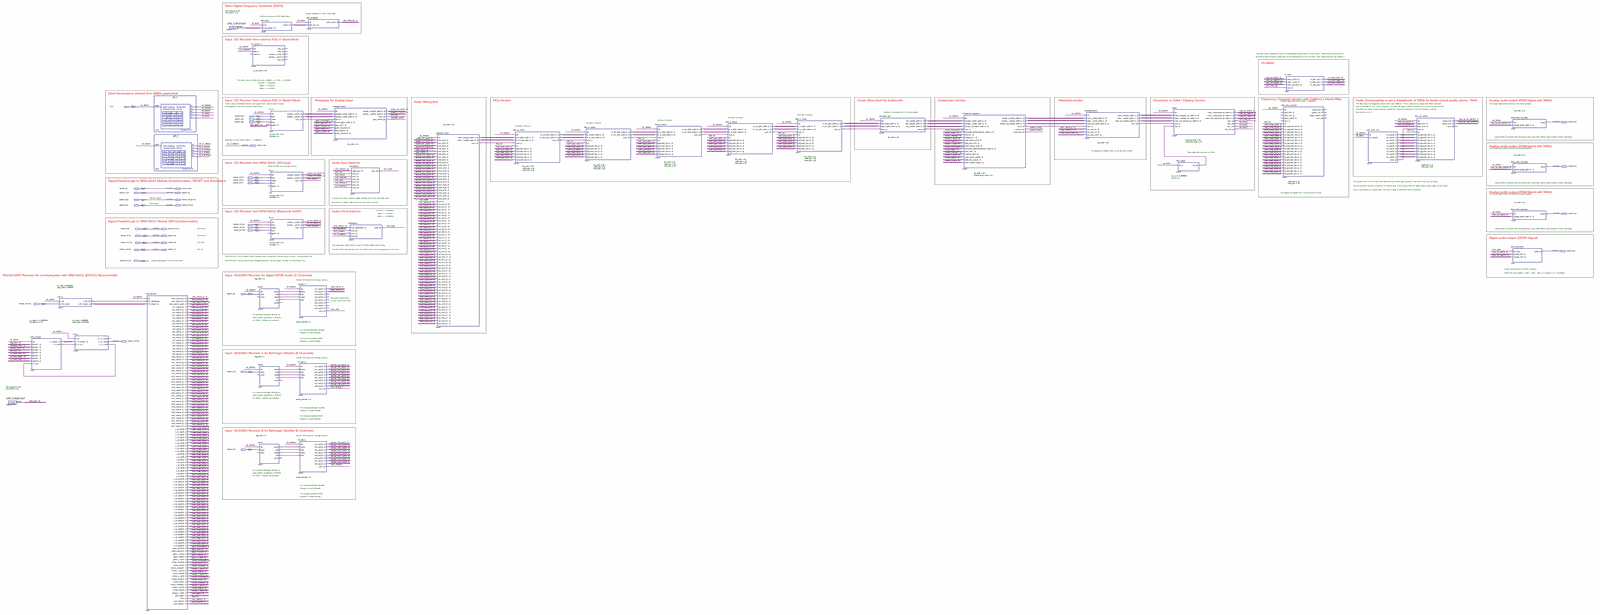
[diagram p0: schematic sheet, whole]
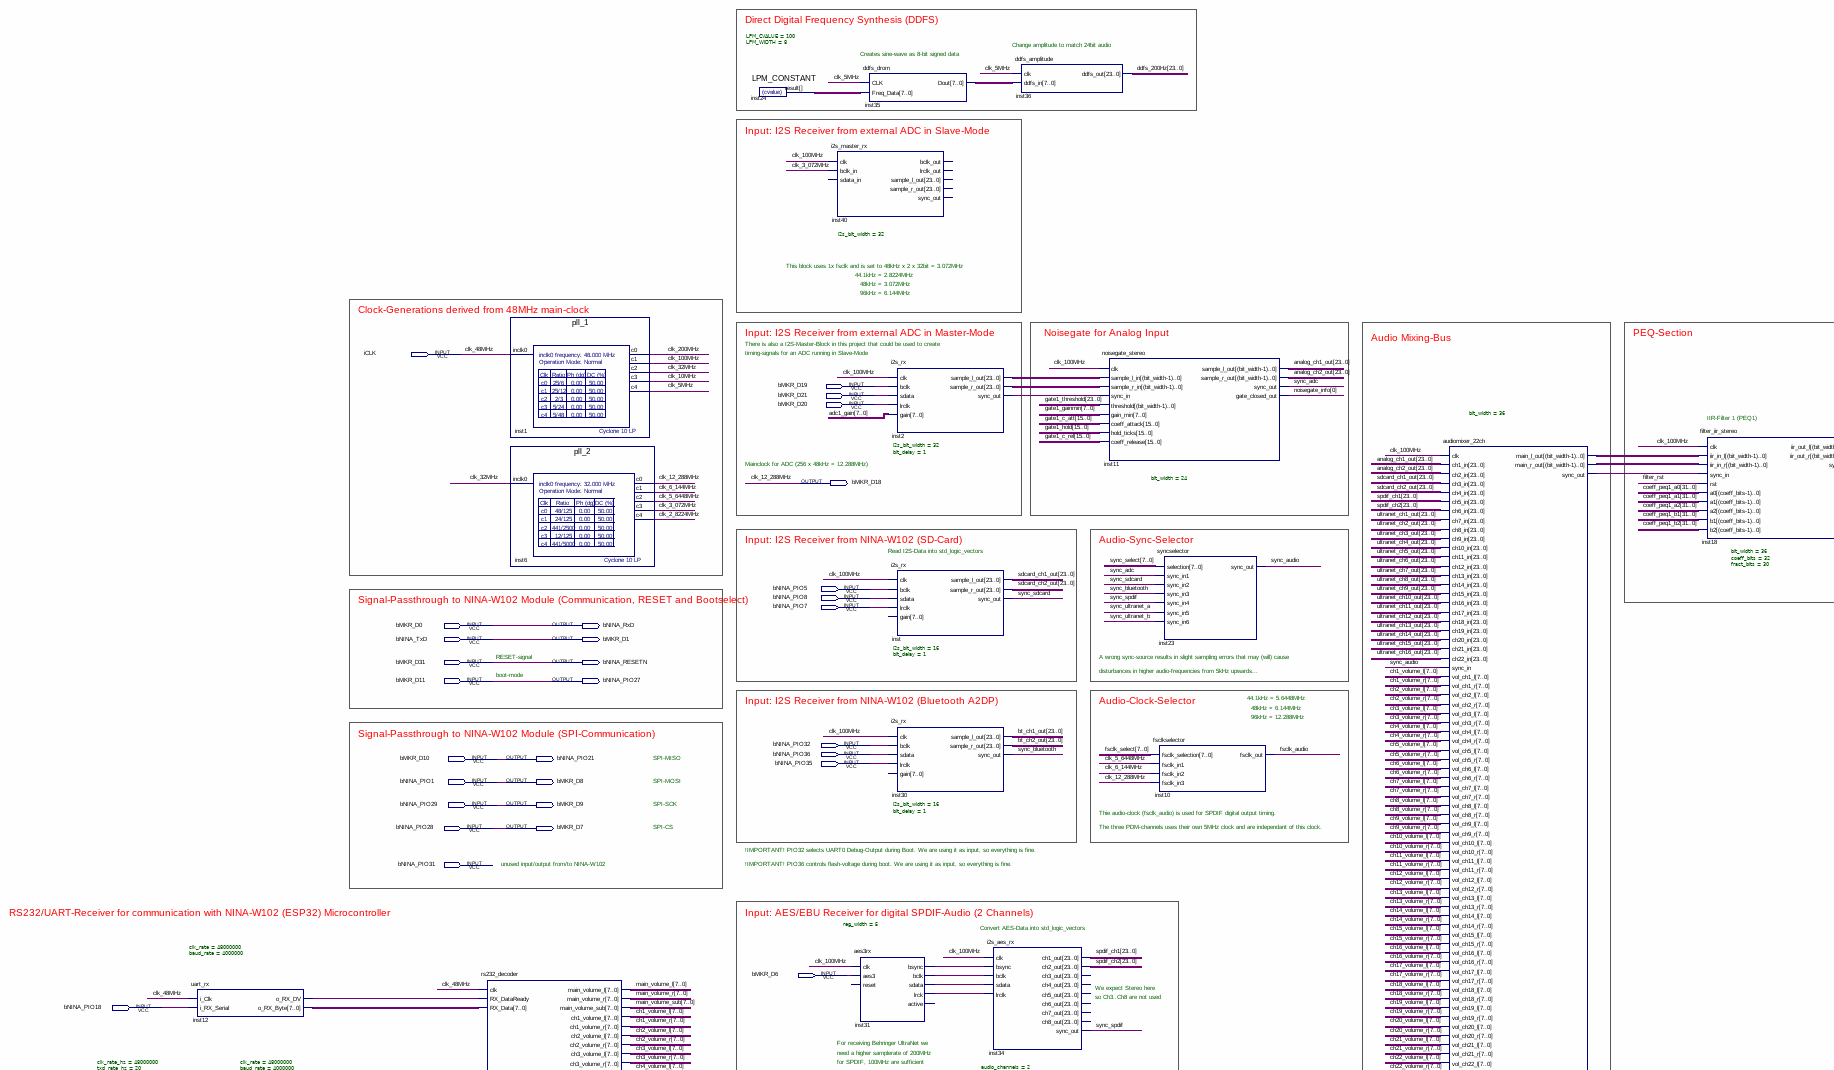
[diagram p1: schematic sheet, upper left part]
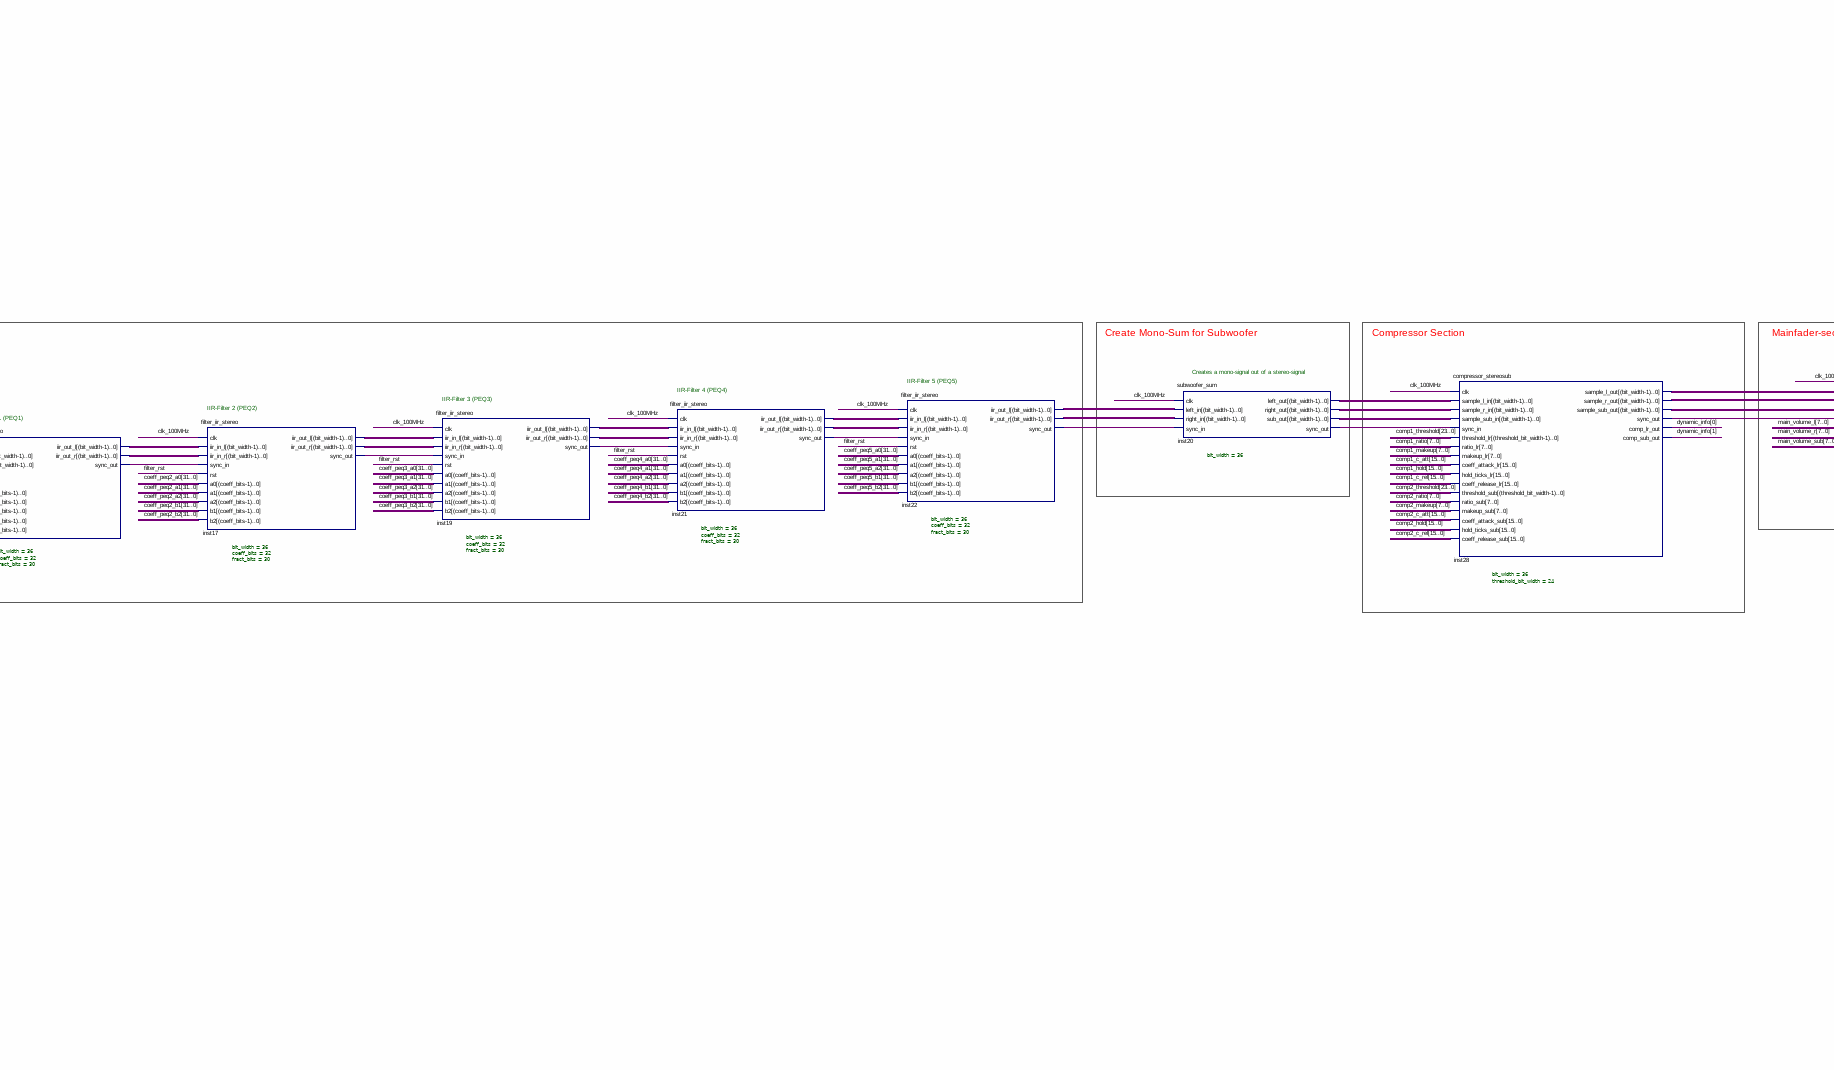
[diagram p2: schematic sheet, upper centre part]
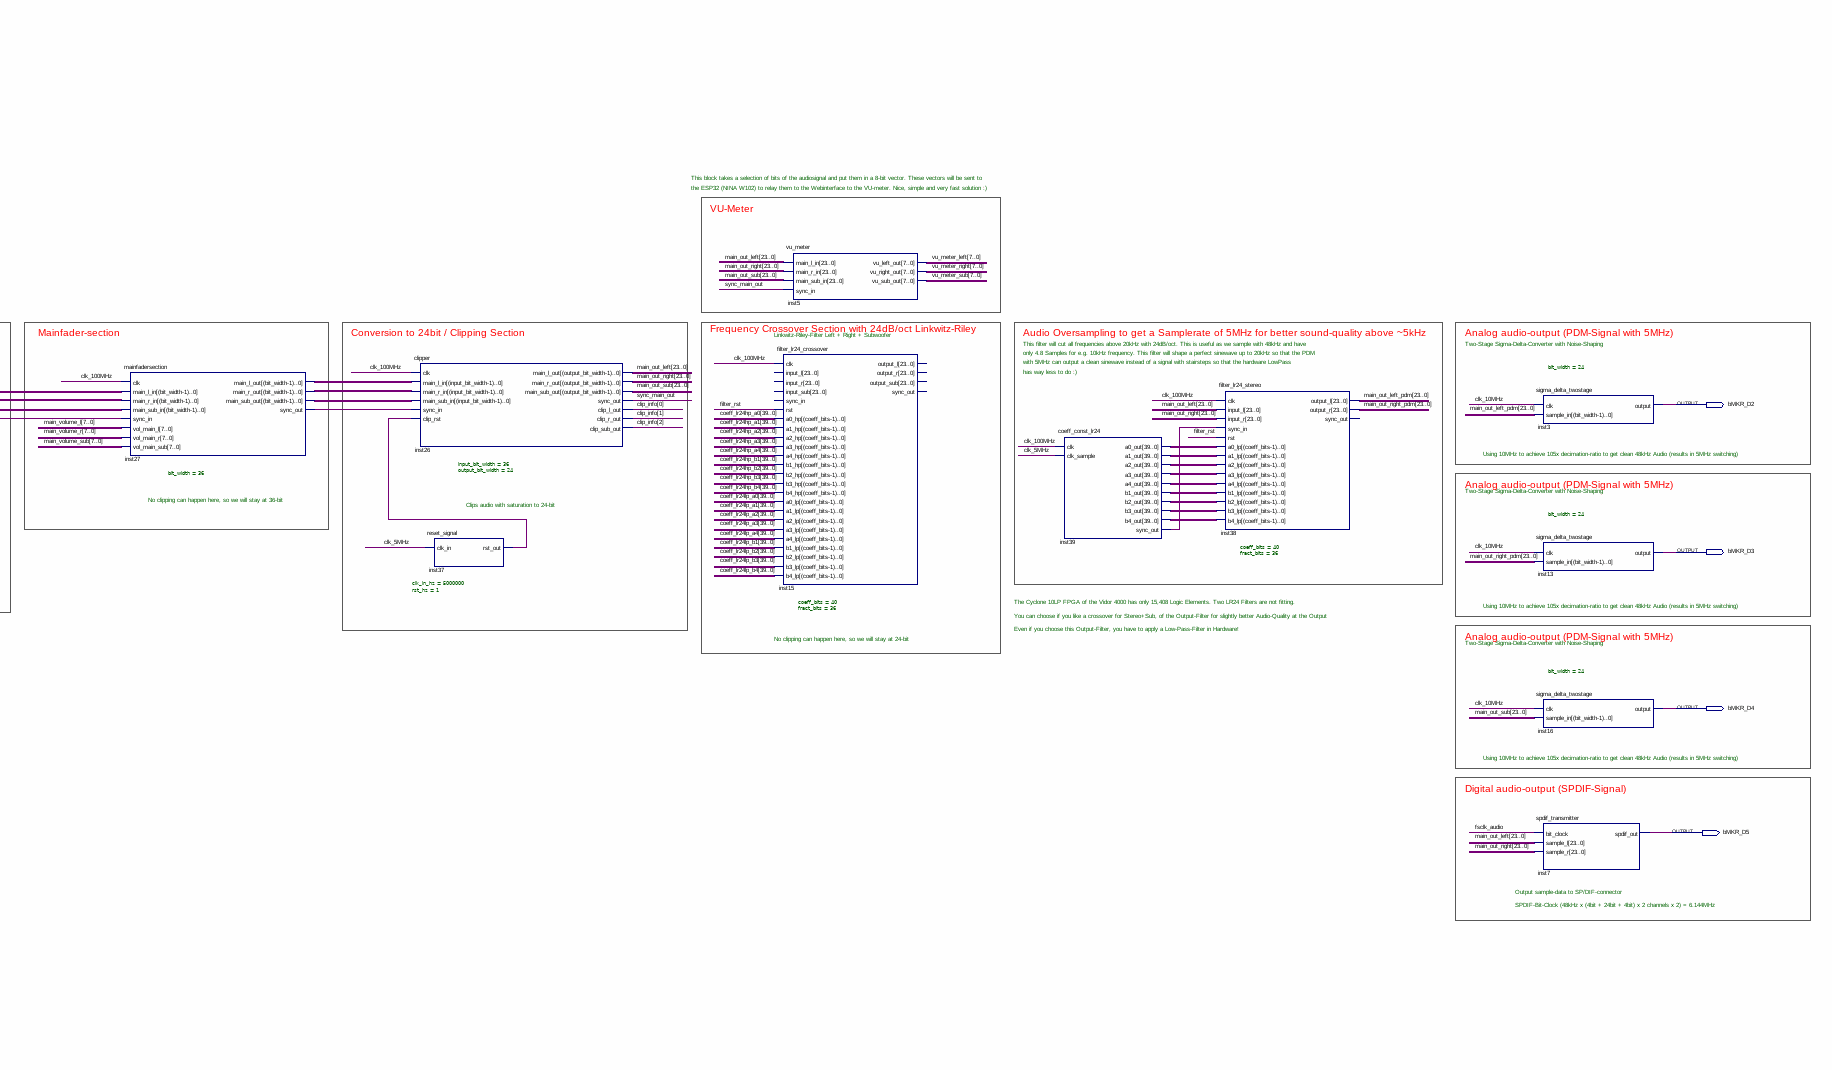
[diagram p3: schematic sheet, upper right part]
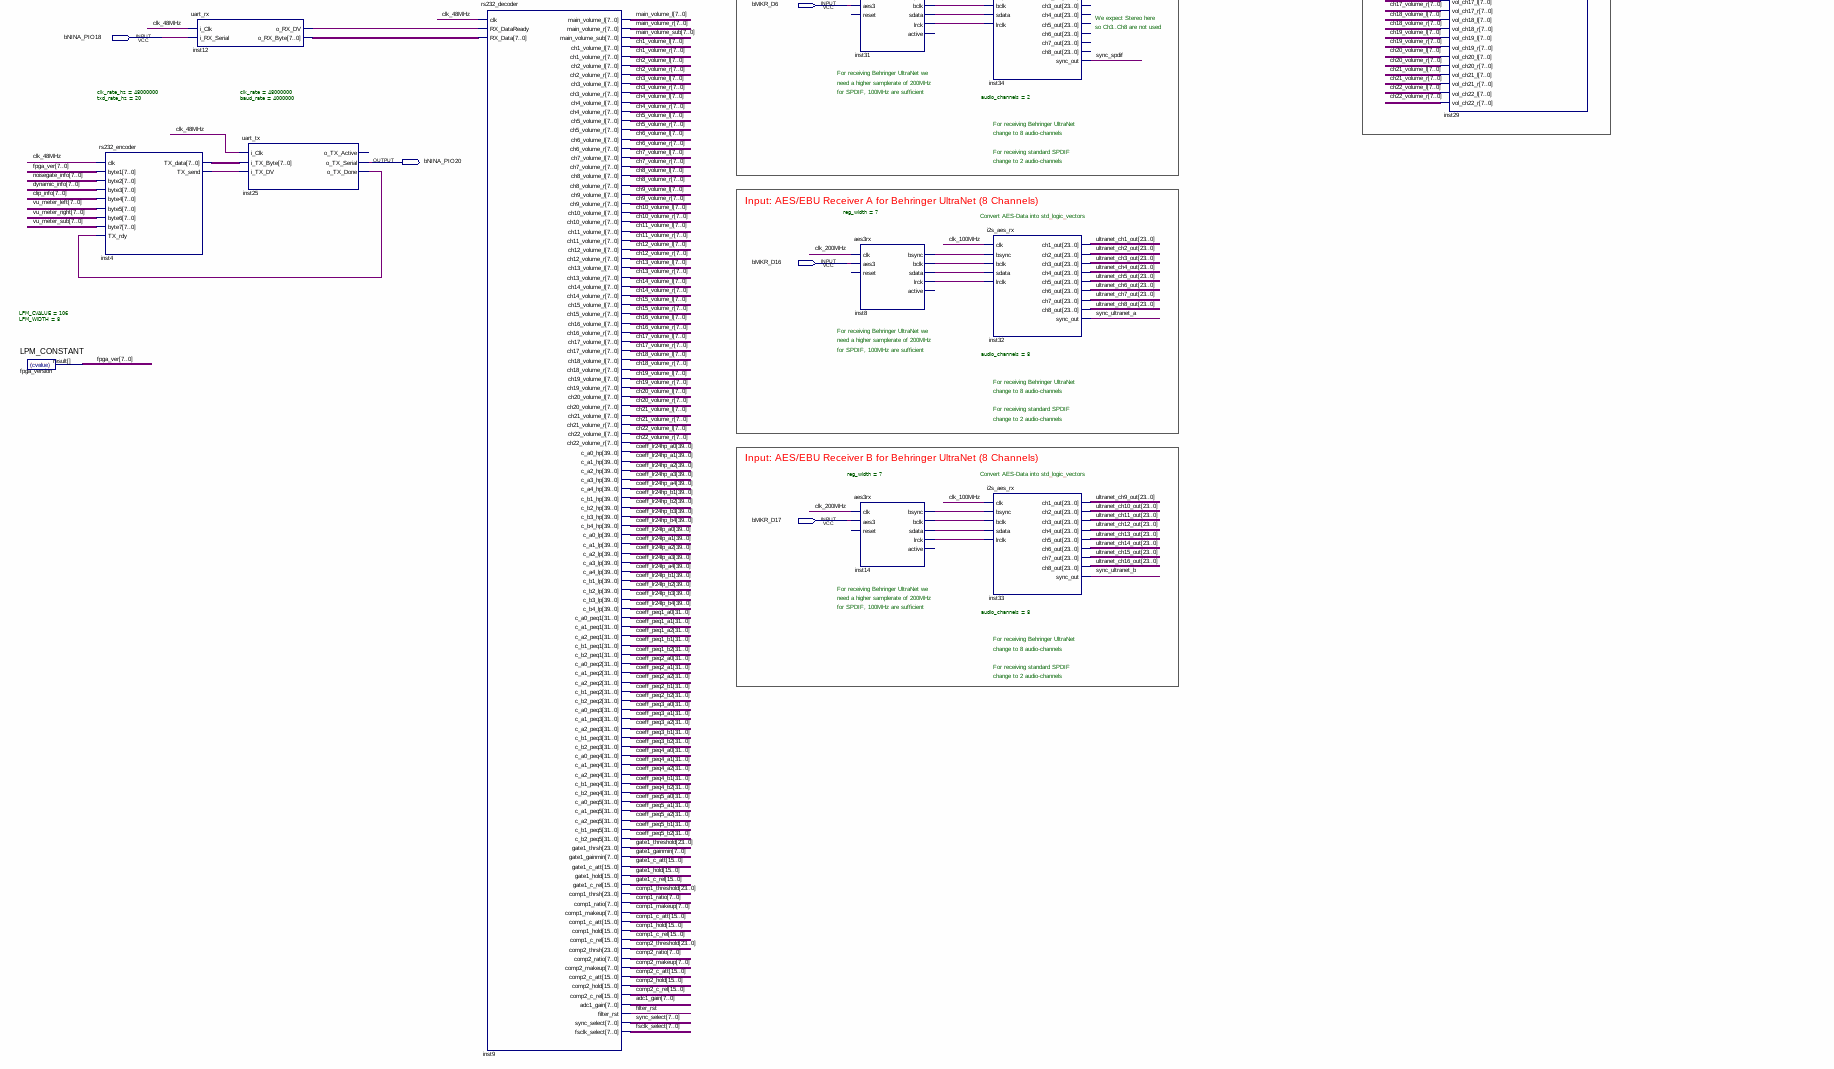
[diagram p4: schematic sheet, lower left part]
// Quartus schematic Audioplayer.bdf as structural Verilog: 42 symbols, 37 pins
module Audioplayer (
  input  iCLK,
  input  bMKR_D19,
  input  bMKR_D21,
  input  bMKR_D20,
  input  bNINA_PIO5,
  input  bNINA_PIO8,
  input  bNINA_PIO7,
  input  bMKR_D0,
  input  bNINA_TxD,
  input  bMKR_D31,
  input  bMKR_D11,
  input  bNINA_PIO32,
  input  bNINA_PIO36,
  input  bMKR_D10,
  input  bNINA_PIO35,
  input  bNINA_PIO1,
  input  bNINA_PIO29,
  input  bNINA_PIO28,
  input  bNINA_PIO31,
  input  bMKR_D6,
  input  bNINA_PIO18,
  input  bMKR_D16,
  input  bMKR_D17,
  output bMKR_D2,
  output bMKR_D18,
  output bMKR_D3,
  output bNINA_RxD,
  output bMKR_D1,
  output bNINA_RESETN,
  output bNINA_PIO27,
  output bMKR_D4,
  output bNINA_PIO21,
  output bMKR_D8,
  output bMKR_D9,
  output bMKR_D7,
  output bMKR_D5,
  output bNINA_PIO20
);

  wire clk_2_8224MHz, clk_3_072MHz, clk_5_6448MHz, clk_5MHz, clk_6_144MHz, clk_10MHz, clk_32MHz, clk_100MHz,
       clk_200MHz, filter_rst, fsclk_audio, inst2_sync_out, inst4_tx_send, inst8_bclk, inst8_bsync,
       inst8_lrck, inst8_sdata, inst12_o_rx_dv, inst14_bclk, inst14_bsync, inst14_lrck, inst14_sdata,
       inst17_sync_out, inst18_sync_out, inst19_sync_out, inst20_sync_out, inst21_sync_out, inst22_sync_out,
       inst25_o_tx_done, inst27_sync_out, inst28_sync_out, inst29_sync_out, inst31_bclk, inst31_bsync,
       inst31_lrck, inst31_sdata, inst37_rst_out, inst39_sync_out, sync_adc, sync_audio, sync_bluetooth,
       sync_main_out, sync_sdcard, sync_spdif, sync_ultranet_a, sync_ultranet_b;
  wire [7:0] adc1_gain, ch1_volume_l, ch1_volume_r, ch2_volume_l, ch2_volume_r, ch3_volume_l, ch3_volume_r,
       ch4_volume_l, ch4_volume_r, ch5_volume_l, ch5_volume_r, ch6_volume_l, ch6_volume_r, ch7_volume_l,
       ch7_volume_r, ch8_volume_l, ch8_volume_r, ch9_volume_l, ch9_volume_r, ch10_volume_l, ch10_volume_r,
       ch11_volume_l, ch11_volume_r, ch12_volume_l, ch12_volume_r, ch13_volume_l, ch13_volume_r,
       ch14_volume_l, ch14_volume_r, ch15_volume_l, ch15_volume_r, ch16_volume_l, ch16_volume_r,
       ch17_volume_l, ch17_volume_r, ch18_volume_l, ch18_volume_r, ch19_volume_l, ch19_volume_r,
       ch20_volume_l, ch20_volume_r, ch21_volume_l, ch21_volume_r, ch22_volume_l, ch22_volume_r, clip_info,
       comp1_makeup, comp1_ratio, comp2_makeup, comp2_ratio, dynamic_info, fpga_ver, fsclk_select,
       gate1_gainmin, inst4_tx_data, inst12_o_rx_byte, inst24_result, inst35_dout, main_volume_l,
       main_volume_r, main_volume_sub, noisegate_info, sync_select, vu_meter_left, vu_meter_right,
       vu_meter_sub;
  wire [15:0] comp1_c_att, comp1_c_rel, comp1_hold, comp2_c_att, comp2_c_rel, comp2_hold, gate1_c_att,
       gate1_c_rel, gate1_hold;
  wire [23:0] analog_ch1_out, analog_ch2_out, bt_ch1_out, bt_ch2_out, comp1_threshold, comp2_threshold,
       ddfs_200Hz, gate1_threshold, inst2_sample_l_out, inst2_sample_r_out, main_out_left, main_out_left_pdm,
       main_out_right, main_out_right_pdm, main_out_sub, sdcard_ch1_out, sdcard_ch2_out, spdif_ch1,
       spdif_ch2, ultranet_ch1_out, ultranet_ch2_out, ultranet_ch3_out, ultranet_ch4_out, ultranet_ch5_out,
       ultranet_ch6_out, ultranet_ch7_out, ultranet_ch8_out, ultranet_ch9_out, ultranet_ch10_out,
       ultranet_ch11_out, ultranet_ch12_out, ultranet_ch13_out, ultranet_ch14_out, ultranet_ch15_out,
       ultranet_ch16_out;
  wire [31:0] coeff_peq1_a0, coeff_peq1_a1, coeff_peq1_a2, coeff_peq1_b1, coeff_peq1_b2, coeff_peq2_a0,
       coeff_peq2_a1, coeff_peq2_a2, coeff_peq2_b1, coeff_peq2_b2, coeff_peq3_a0, coeff_peq3_a1,
       coeff_peq3_a2, coeff_peq3_b1, coeff_peq3_b2, coeff_peq4_a0, coeff_peq4_a1, coeff_peq4_a2,
       coeff_peq4_b1, coeff_peq4_b2, coeff_peq5_a0, coeff_peq5_a1, coeff_peq5_a2, coeff_peq5_b1,
       coeff_peq5_b2;
  wire [35:0] inst17_iir_out_l, inst17_iir_out_r, inst18_iir_out_l, inst18_iir_out_r, inst19_iir_out_l,
       inst19_iir_out_r, inst20_left_out, inst20_right_out, inst20_sub_out, inst21_iir_out_l,
       inst21_iir_out_r, inst22_iir_out_l, inst22_iir_out_r, inst27_main_l_out, inst27_main_r_out,
       inst27_main_sub_out, inst28_sample_l_out, inst28_sample_r_out, inst28_sample_sub_out,
       inst29_main_l_out, inst29_main_r_out;
  wire [39:0] coeff_lr24hp_a0, coeff_lr24hp_a1, coeff_lr24hp_a2, coeff_lr24hp_a3, coeff_lr24hp_a4,
       coeff_lr24hp_b1, coeff_lr24hp_b2, coeff_lr24hp_b3, coeff_lr24hp_b4, coeff_lr24lp_a0, coeff_lr24lp_a1,
       coeff_lr24lp_a2, coeff_lr24lp_a3, coeff_lr24lp_a4, coeff_lr24lp_b1, coeff_lr24lp_b2, coeff_lr24lp_b3,
       coeff_lr24lp_b4, inst39_a0_out, inst39_a1_out, inst39_a2_out, inst39_a3_out, inst39_a4_out,
       inst39_b1_out, inst39_b2_out, inst39_b3_out, inst39_b4_out;

  LPM_CONSTANT #(.LPM_CVALUE(106), .LPM_WIDTH(8)) fpga_version (.result(fpga_ver));
  rs232_encoder #(.clk_rate_hz(48000000), .txd_rate_hz(20)) inst4 (
    .clk(iCLK), .byte1(fpga_ver), .byte2(noisegate_info), .byte3(dynamic_info), .byte4(clip_info),
    .byte5(vu_meter_left), .byte6(vu_meter_right), .byte7(vu_meter_sub), .TX_rdy(inst25_o_tx_done),
    .TX_data(inst4_tx_data), .TX_send(inst4_tx_send));
  uart_rx #(.clk_rate(48000000), .baud_rate(4000000)) inst12 (
    .i_Clk(iCLK), .i_RX_Serial(bNINA_PIO18), .o_RX_DV(inst12_o_rx_dv), .o_RX_Byte(inst12_o_rx_byte));
  uart_tx #(.clk_rate(48000000), .baud_rate(4000000)) inst25 (
    .i_Clk(iCLK), .i_TX_Byte(inst4_tx_data), .i_TX_DV(inst4_tx_send), .o_TX_Serial(bNINA_PIO20),
    .o_TX_Done(inst25_o_tx_done));  // open: o_TX_Active
  rs232_decoder inst9 (
    .clk(iCLK), .RX_DataReady(inst12_o_rx_dv), .RX_Data(inst12_o_rx_byte), .main_volume_l(main_volume_l),
    .main_volume_r(main_volume_r), .main_volume_sub(main_volume_sub), .ch1_volume_l(ch1_volume_l),
    .ch1_volume_r(ch1_volume_r), .ch2_volume_l(ch2_volume_l), .ch2_volume_r(ch2_volume_r),
    .ch3_volume_l(ch3_volume_l), .ch3_volume_r(ch3_volume_r), .ch4_volume_l(ch4_volume_l),
    .ch4_volume_r(ch4_volume_r), .ch5_volume_l(ch5_volume_l), .ch5_volume_r(ch5_volume_r),
    .ch6_volume_l(ch6_volume_l), .ch6_volume_r(ch6_volume_r), .ch7_volume_l(ch7_volume_l),
    .ch7_volume_r(ch7_volume_r), .ch8_volume_l(ch8_volume_l), .ch8_volume_r(ch8_volume_r),
    .ch9_volume_l(ch9_volume_l), .ch9_volume_r(ch9_volume_r), .ch10_volume_l(ch10_volume_l),
    .ch10_volume_r(ch10_volume_r), .ch11_volume_l(ch11_volume_l), .ch11_volume_r(ch11_volume_r),
    .ch12_volume_l(ch12_volume_l), .ch12_volume_r(ch12_volume_r), .ch13_volume_l(ch13_volume_l),
    .ch13_volume_r(ch13_volume_r), .ch14_volume_l(ch14_volume_l), .ch14_volume_r(ch14_volume_r),
    .ch15_volume_l(ch15_volume_l), .ch15_volume_r(ch15_volume_r), .ch16_volume_l(ch16_volume_l),
    .ch16_volume_r(ch16_volume_r), .ch17_volume_l(ch17_volume_l), .ch17_volume_r(ch17_volume_r),
    .ch18_volume_l(ch18_volume_l), .ch18_volume_r(ch18_volume_r), .ch19_volume_l(ch19_volume_l),
    .ch19_volume_r(ch19_volume_r), .ch20_volume_l(ch20_volume_l), .ch20_volume_r(ch20_volume_r),
    .ch21_volume_l(ch21_volume_l), .ch21_volume_r(ch21_volume_r), .ch22_volume_l(ch22_volume_l),
    .ch22_volume_r(ch22_volume_r), .c_a0_hp(coeff_lr24hp_a0), .c_a1_hp(coeff_lr24hp_a1),
    .c_a2_hp(coeff_lr24hp_a2), .c_a3_hp(coeff_lr24hp_a3), .c_a4_hp(coeff_lr24hp_a4),
    .c_b1_hp(coeff_lr24hp_b1), .c_b2_hp(coeff_lr24hp_b2), .c_b3_hp(coeff_lr24hp_b3),
    .c_b4_hp(coeff_lr24hp_b4), .c_a0_lp(coeff_lr24lp_a0), .c_a1_lp(coeff_lr24lp_a1),
    .c_a2_lp(coeff_lr24lp_a2), .c_a3_lp(coeff_lr24lp_a3), .c_a4_lp(coeff_lr24lp_a4),
    .c_b1_lp(coeff_lr24lp_b1), .c_b2_lp(coeff_lr24lp_b2), .c_b3_lp(coeff_lr24lp_b3),
    .c_b4_lp(coeff_lr24lp_b4), .c_a0_peq1(coeff_peq1_a0), .c_a1_peq1(coeff_peq1_a1),
    .c_a2_peq1(coeff_peq1_a2), .c_b1_peq1(coeff_peq1_b1), .c_b2_peq1(coeff_peq1_b2),
    .c_a0_peq2(coeff_peq2_a0), .c_a1_peq2(coeff_peq2_a1), .c_a2_peq2(coeff_peq2_a2),
    .c_b1_peq2(coeff_peq2_b1), .c_b2_peq2(coeff_peq2_b2), .c_a0_peq3(coeff_peq3_a0),
    .c_a1_peq3(coeff_peq3_a1), .c_a2_peq3(coeff_peq3_a2), .c_b1_peq3(coeff_peq3_b1),
    .c_b2_peq3(coeff_peq3_b2), .c_a0_peq4(coeff_peq4_a0), .c_a1_peq4(coeff_peq4_a1),
    .c_a2_peq4(coeff_peq4_a2), .c_b1_peq4(coeff_peq4_b1), .c_b2_peq4(coeff_peq4_b2),
    .c_a0_peq5(coeff_peq5_a0), .c_a1_peq5(coeff_peq5_a1), .c_a2_peq5(coeff_peq5_a2),
    .c_b1_peq5(coeff_peq5_b1), .c_b2_peq5(coeff_peq5_b2), .gate1_thrsh(gate1_threshold),
    .gate1_gainmin(gate1_gainmin), .gate1_c_att(gate1_c_att), .gate1_hold(gate1_hold),
    .gate1_c_rel(gate1_c_rel), .comp1_thrsh(comp1_threshold), .comp1_ratio(comp1_ratio),
    .comp1_makeup(comp1_makeup), .comp1_c_att(comp1_c_att), .comp1_hold(comp1_hold),
    .comp1_c_rel(comp1_c_rel), .comp2_thrsh(comp2_threshold), .comp2_ratio(comp2_ratio),
    .comp2_makeup(comp2_makeup), .comp2_c_att(comp2_c_att), .comp2_hold(comp2_hold),
    .comp2_c_rel(comp2_c_rel), .adc1_gain(adc1_gain), .filter_rst(filter_rst), .sync_select(sync_select),
    .fsclk_select(fsclk_select));
  pll_1 inst1 (.inclk0(iCLK), .c0(clk_200MHz), .c1(clk_100MHz), .c2(clk_32MHz), .c3(clk_10MHz), .c4(clk_5MHz));
  pll_2 inst6 (
    .inclk0(clk_32MHz), .c0(bMKR_D18), .c1(clk_6_144MHz), .c2(clk_5_6448MHz), .c3(clk_3_072MHz),
    .c4(clk_2_8224MHz));
  LPM_CONSTANT #(.LPM_CVALUE(100), .LPM_WIDTH(8)) inst24 (.result(inst24_result));
  i2s_master_rx #(.i2s_bit_width(32)) inst40 (
    .clk(clk_100MHz), .bclk_in(clk_3_072MHz));  // open: sdata_in, bclk_out, lrclk_out, sample_l_out, sample_r_out, sync_out
  ddfs_drom inst35 (.CLK(clk_5MHz), .Freq_Data(inst24_result), .Dout(inst35_dout));
  aes3rx #(.reg_width(5)) inst31 (
    .clk(clk_100MHz), .aes3(bMKR_D6), .bsync(inst31_bsync), .bclk(inst31_bclk), .sdata(inst31_sdata),
    .lrck(inst31_lrck));  // open: reset, active
  aes3rx #(.reg_width(7)) inst8 (
    .clk(clk_200MHz), .aes3(bMKR_D16), .bsync(inst8_bsync), .bclk(inst8_bclk), .sdata(inst8_sdata),
    .lrck(inst8_lrck));  // open: reset, active
  aes3rx #(.reg_width(7)) inst14 (
    .clk(clk_200MHz), .aes3(bMKR_D17), .bsync(inst14_bsync), .bclk(inst14_bclk), .sdata(inst14_sdata),
    .lrck(inst14_lrck));  // open: reset, active
  i2s_rx #(.i2s_bit_width(32), .bit_delay(1)) inst2 (
    .clk(clk_100MHz), .bclk(bMKR_D19), .sdata(bMKR_D21), .lrclk(bMKR_D20), .gain(adc1_gain),
    .sample_l_out(inst2_sample_l_out), .sample_r_out(inst2_sample_r_out), .sync_out(inst2_sync_out));
  i2s_rx #(.i2s_bit_width(16), .bit_delay(1)) inst (
    .clk(clk_100MHz), .bclk(bNINA_PIO5), .sdata(bNINA_PIO8), .lrclk(bNINA_PIO7),
    .sample_l_out(sdcard_ch1_out), .sample_r_out(sdcard_ch2_out), .sync_out(sync_sdcard));  // open: gain
  i2s_rx #(.i2s_bit_width(16), .bit_delay(1)) inst30 (
    .clk(clk_100MHz), .bclk(bNINA_PIO32), .sdata(bNINA_PIO36), .lrclk(bNINA_PIO35),
    .sample_l_out(bt_ch1_out), .sample_r_out(bt_ch2_out), .sync_out(sync_bluetooth));  // open: gain
  i2s_aes_rx #(.audio_channels(2)) inst34 (
    .clk(clk_100MHz), .bsync(inst31_bsync), .bclk(inst31_bclk), .sdata(inst31_sdata), .lrclk(inst31_lrck),
    .ch1_out(spdif_ch1), .ch2_out(spdif_ch2), .sync_out(sync_spdif));  // open: ch3_out, ch4_out, ch5_out, ch6_out, ch7_out, ch8_out
  i2s_aes_rx #(.audio_channels(8)) inst32 (
    .clk(clk_100MHz), .bsync(inst8_bsync), .bclk(inst8_bclk), .sdata(inst8_sdata), .lrclk(inst8_lrck),
    .ch1_out(ultranet_ch1_out), .ch2_out(ultranet_ch2_out), .ch3_out(ultranet_ch3_out),
    .ch4_out(ultranet_ch4_out), .ch5_out(ultranet_ch5_out), .ch6_out(ultranet_ch6_out),
    .ch7_out(ultranet_ch7_out), .ch8_out(ultranet_ch8_out), .sync_out(sync_ultranet_a));
  i2s_aes_rx #(.audio_channels(8)) inst33 (
    .clk(clk_100MHz), .bsync(inst14_bsync), .bclk(inst14_bclk), .sdata(inst14_sdata), .lrclk(inst14_lrck),
    .ch1_out(ultranet_ch9_out), .ch2_out(ultranet_ch10_out), .ch3_out(ultranet_ch11_out),
    .ch4_out(ultranet_ch12_out), .ch5_out(ultranet_ch13_out), .ch6_out(ultranet_ch14_out),
    .ch7_out(ultranet_ch15_out), .ch8_out(ultranet_ch16_out), .sync_out(sync_ultranet_b));
  ddfs_amplitude inst36 (.clk(clk_5MHz), .ddfs_in(inst35_dout), .ddfs_out(ddfs_200Hz));
  noisegate_stereo #(.bit_width(24)) inst11 (
    .clk(clk_100MHz), .sample_l_in(inst2_sample_l_out), .sample_r_in(inst2_sample_r_out),
    .sync_in(inst2_sync_out), .threshold(gate1_threshold), .gain_min(gate1_gainmin),
    .coeff_attack(gate1_c_att), .hold_ticks(gate1_hold), .coeff_release(gate1_c_rel),
    .sample_l_out(analog_ch1_out), .sample_r_out(analog_ch2_out), .sync_out(sync_adc),
    .gate_closed_out(noisegate_info[0]));
  syncselector inst23 (
    .selection(sync_select), .sync_in1(sync_adc), .sync_in2(sync_sdcard), .sync_in3(sync_bluetooth),
    .sync_in4(sync_spdif), .sync_in5(sync_ultranet_a), .sync_in6(sync_ultranet_b), .sync_out(sync_audio));
  fsclkselector inst10 (
    .fsclk_selection(fsclk_select), .fsclk_in1(clk_5_6448MHz), .fsclk_in2(clk_6_144MHz),
    .fsclk_in3(bMKR_D18), .fsclk_out(fsclk_audio));
  audiomixer_22ch #(.bit_width(36)) inst29 (
    .clk(clk_100MHz), .ch1_in(analog_ch1_out), .ch2_in(analog_ch2_out), .ch3_in(sdcard_ch1_out),
    .ch4_in(sdcard_ch2_out), .ch5_in(spdif_ch1), .ch6_in(spdif_ch2), .ch7_in(ultranet_ch1_out),
    .ch8_in(ultranet_ch2_out), .ch9_in(ultranet_ch3_out), .ch10_in(ultranet_ch4_out),
    .ch11_in(ultranet_ch5_out), .ch12_in(ultranet_ch6_out), .ch13_in(ultranet_ch7_out),
    .ch14_in(ultranet_ch8_out), .ch15_in(ultranet_ch9_out), .ch16_in(ultranet_ch10_out),
    .ch17_in(ultranet_ch11_out), .ch18_in(ultranet_ch12_out), .ch19_in(ultranet_ch13_out),
    .ch20_in(ultranet_ch14_out), .ch21_in(ultranet_ch15_out), .ch22_in(ultranet_ch16_out),
    .sync_in(sync_audio), .vol_ch1_l(ch1_volume_l), .vol_ch1_r(ch1_volume_r), .vol_ch2_l(ch2_volume_l),
    .vol_ch2_r(ch2_volume_r), .vol_ch3_l(ch3_volume_l), .vol_ch3_r(ch3_volume_r), .vol_ch4_l(ch4_volume_l),
    .vol_ch4_r(ch4_volume_r), .vol_ch5_l(ch5_volume_l), .vol_ch5_r(ch5_volume_r), .vol_ch6_l(ch6_volume_l),
    .vol_ch6_r(ch6_volume_r), .vol_ch7_l(ch7_volume_l), .vol_ch7_r(ch7_volume_r), .vol_ch8_l(ch8_volume_l),
    .vol_ch8_r(ch8_volume_r), .vol_ch9_l(ch9_volume_l), .vol_ch9_r(ch9_volume_r), .vol_ch10_l(ch10_volume_l),
    .vol_ch10_r(ch10_volume_r), .vol_ch11_l(ch11_volume_l), .vol_ch11_r(ch11_volume_r),
    .vol_ch12_l(ch12_volume_l), .vol_ch12_r(ch12_volume_r), .vol_ch13_l(ch13_volume_l),
    .vol_ch13_r(ch13_volume_r), .vol_ch14_l(ch14_volume_l), .vol_ch14_r(ch14_volume_r),
    .vol_ch15_l(ch15_volume_l), .vol_ch15_r(ch15_volume_r), .vol_ch16_l(ch16_volume_l),
    .vol_ch16_r(ch16_volume_r), .vol_ch17_l(ch17_volume_l), .vol_ch17_r(ch17_volume_r),
    .vol_ch18_l(ch18_volume_l), .vol_ch18_r(ch18_volume_r), .vol_ch19_l(ch19_volume_l),
    .vol_ch19_r(ch19_volume_r), .vol_ch20_l(ch20_volume_l), .vol_ch20_r(ch20_volume_r),
    .vol_ch21_l(ch21_volume_l), .vol_ch21_r(ch21_volume_r), .vol_ch22_l(ch22_volume_l),
    .vol_ch22_r(ch22_volume_r), .main_l_out(inst29_main_l_out), .main_r_out(inst29_main_r_out),
    .sync_out(inst29_sync_out));
  filter_iir_stereo #(.bit_width(36), .coeff_bits(32), .fract_bits(30)) inst18 (
    .clk(clk_100MHz), .iir_in_l(inst29_main_l_out), .iir_in_r(inst29_main_r_out), .sync_in(inst29_sync_out),
    .rst(filter_rst), .a0(coeff_peq1_a0), .a1(coeff_peq1_a1), .a2(coeff_peq1_a2), .b1(coeff_peq1_b1),
    .b2(coeff_peq1_b2), .iir_out_l(inst18_iir_out_l), .iir_out_r(inst18_iir_out_r), .sync_out(inst18_sync_out));
  filter_iir_stereo #(.bit_width(36), .coeff_bits(32), .fract_bits(30)) inst17 (
    .clk(clk_100MHz), .iir_in_l(inst18_iir_out_l), .iir_in_r(inst18_iir_out_r), .sync_in(inst18_sync_out),
    .rst(filter_rst), .a0(coeff_peq2_a0), .a1(coeff_peq2_a1), .a2(coeff_peq2_a2), .b1(coeff_peq2_b1),
    .b2(coeff_peq2_b2), .iir_out_l(inst17_iir_out_l), .iir_out_r(inst17_iir_out_r), .sync_out(inst17_sync_out));
  filter_iir_stereo #(.bit_width(36), .coeff_bits(32), .fract_bits(30)) inst19 (
    .clk(clk_100MHz), .iir_in_l(inst17_iir_out_l), .iir_in_r(inst17_iir_out_r), .sync_in(inst17_sync_out),
    .rst(filter_rst), .a0(coeff_peq3_a0), .a1(coeff_peq3_a1), .a2(coeff_peq3_a2), .b1(coeff_peq3_b1),
    .b2(coeff_peq3_b2), .iir_out_l(inst19_iir_out_l), .iir_out_r(inst19_iir_out_r), .sync_out(inst19_sync_out));
  filter_iir_stereo #(.bit_width(36), .coeff_bits(32), .fract_bits(30)) inst21 (
    .clk(clk_100MHz), .iir_in_l(inst19_iir_out_l), .iir_in_r(inst19_iir_out_r), .sync_in(inst19_sync_out),
    .rst(filter_rst), .a0(coeff_peq4_a0), .a1(coeff_peq4_a1), .a2(coeff_peq4_a2), .b1(coeff_peq4_b1),
    .b2(coeff_peq4_b2), .iir_out_l(inst21_iir_out_l), .iir_out_r(inst21_iir_out_r), .sync_out(inst21_sync_out));
  filter_iir_stereo #(.bit_width(36), .coeff_bits(32), .fract_bits(30)) inst22 (
    .clk(clk_100MHz), .iir_in_l(inst21_iir_out_l), .iir_in_r(inst21_iir_out_r), .sync_in(inst21_sync_out),
    .rst(filter_rst), .a0(coeff_peq5_a0), .a1(coeff_peq5_a1), .a2(coeff_peq5_a2), .b1(coeff_peq5_b1),
    .b2(coeff_peq5_b2), .iir_out_l(inst22_iir_out_l), .iir_out_r(inst22_iir_out_r), .sync_out(inst22_sync_out));
  subwoofer_sum #(.bit_width(36)) inst20 (
    .clk(clk_100MHz), .left_in(inst22_iir_out_l), .right_in(inst22_iir_out_r), .sync_in(inst22_sync_out),
    .left_out(inst20_left_out), .right_out(inst20_right_out), .sub_out(inst20_sub_out),
    .sync_out(inst20_sync_out));
  compressor_stereosub #(.bit_width(36), .threshold_bit_width(24)) inst28 (
    .clk(clk_100MHz), .sample_l_in(inst20_left_out), .sample_r_in(inst20_right_out),
    .sample_sub_in(inst20_sub_out), .sync_in(inst20_sync_out), .threshold_lr(comp1_threshold),
    .ratio_lr(comp1_ratio), .makeup_lr(comp1_makeup), .coeff_attack_lr(comp1_c_att),
    .hold_ticks_lr(comp1_hold), .coeff_release_lr(comp1_c_rel), .threshold_sub(comp2_threshold),
    .ratio_sub(comp2_ratio), .makeup_sub(comp2_makeup), .coeff_attack_sub(comp2_c_att),
    .hold_ticks_sub(comp2_hold), .coeff_release_sub(comp2_c_rel), .sample_l_out(inst28_sample_l_out),
    .sample_r_out(inst28_sample_r_out), .sample_sub_out(inst28_sample_sub_out), .sync_out(inst28_sync_out),
    .comp_lr_out(dynamic_info[0]), .comp_sub_out(dynamic_info[1]));
  mainfadersection #(.bit_width(36)) inst27 (
    .clk(clk_100MHz), .main_l_in(inst28_sample_l_out), .main_r_in(inst28_sample_r_out),
    .main_sub_in(inst28_sample_sub_out), .sync_in(inst28_sync_out), .vol_main_l(main_volume_l),
    .vol_main_r(main_volume_r), .vol_main_sub(main_volume_sub), .main_l_out(inst27_main_l_out),
    .main_r_out(inst27_main_r_out), .main_sub_out(inst27_main_sub_out), .sync_out(inst27_sync_out));
  clipper #(.input_bit_width(36), .output_bit_width(24)) inst26 (
    .clk(clk_100MHz), .main_l_in(inst27_main_l_out), .main_r_in(inst27_main_r_out),
    .main_sub_in(inst27_main_sub_out), .sync_in(inst27_sync_out), .clip_rst(inst37_rst_out),
    .main_l_out(main_out_left), .main_r_out(main_out_right), .main_sub_out(main_out_sub),
    .sync_out(sync_main_out), .clip_l_out(clip_info[0]), .clip_r_out(clip_info[1]),
    .clip_sub_out(clip_info[2]));
  reset_signal #(.clk_in_hz(5000000), .rst_hz(1)) inst37 (.clk_in(clk_5MHz), .rst_out(inst37_rst_out));
  vu_meter inst5 (
    .main_l_in(main_out_left), .main_r_in(main_out_right), .main_sub_in(main_out_sub),
    .sync_in(sync_main_out), .vu_left_out(vu_meter_left), .vu_right_out(vu_meter_right),
    .vu_sub_out(vu_meter_sub));
  filter_lr24_crossover #(.coeff_bits(40), .fract_bits(36)) inst15 (
    .clk(clk_100MHz), .rst(filter_rst), .a0_hp(coeff_lr24hp_a0), .a1_hp(coeff_lr24hp_a1),
    .a2_hp(coeff_lr24hp_a2), .a3_hp(coeff_lr24hp_a3), .a4_hp(coeff_lr24hp_a4), .b1_hp(coeff_lr24hp_b1),
    .b2_hp(coeff_lr24hp_b2), .b3_hp(coeff_lr24hp_b3), .b4_hp(coeff_lr24hp_b4), .a0_lp(coeff_lr24lp_a0),
    .a1_lp(coeff_lr24lp_a1), .a2_lp(coeff_lr24lp_a2), .a3_lp(coeff_lr24lp_a3), .a4_lp(coeff_lr24lp_a4),
    .b1_lp(coeff_lr24lp_b1), .b2_lp(coeff_lr24lp_b2), .b3_lp(coeff_lr24lp_b3), .b4_lp(coeff_lr24lp_b4));  // open: input_l, input_r, input_sub, sync_in, output_l, output_r, output_sub, sync_out
  coeff_const_lr24 inst39 (
    .clk(clk_100MHz), .clk_sample(clk_5MHz), .a0_out(inst39_a0_out), .a1_out(inst39_a1_out),
    .a2_out(inst39_a2_out), .a3_out(inst39_a3_out), .a4_out(inst39_a4_out), .b1_out(inst39_b1_out),
    .b2_out(inst39_b2_out), .b3_out(inst39_b3_out), .b4_out(inst39_b4_out), .sync_out(inst39_sync_out));
  filter_lr24_stereo #(.coeff_bits(40), .fract_bits(36)) inst38 (
    .clk(clk_100MHz), .input_l(main_out_left), .input_r(main_out_right), .sync_in(inst39_sync_out),
    .rst(filter_rst), .a0_lp(inst39_a0_out), .a1_lp(inst39_a1_out), .a2_lp(inst39_a2_out),
    .a3_lp(inst39_a3_out), .a4_lp(inst39_a4_out), .b1_lp(inst39_b1_out), .b2_lp(inst39_b2_out),
    .b3_lp(inst39_b3_out), .b4_lp(inst39_b4_out), .output_l(main_out_left_pdm), .output_r(main_out_right_pdm));  // open: sync_out
  sigma_delta_twostage #(.bit_width(24)) inst3 (.clk(clk_10MHz), .sample_in(main_out_left_pdm), .\output (bMKR_D2));
  sigma_delta_twostage #(.bit_width(24)) inst13 (.clk(clk_10MHz), .sample_in(main_out_right_pdm), .\output (bMKR_D3));
  sigma_delta_twostage #(.bit_width(24)) inst16 (.clk(clk_10MHz), .sample_in(main_out_sub), .\output (bMKR_D4));
  spdif_transmitter inst7 (
    .bit_clock(fsclk_audio), .sample_l(main_out_left), .sample_r(main_out_right), .spdif_out(bMKR_D5));

  assign bMKR_D1 = bNINA_TxD;
  assign bMKR_D7 = bNINA_PIO28;
  assign bMKR_D8 = bNINA_PIO1;
  assign bMKR_D9 = bNINA_PIO29;
  assign bNINA_PIO21 = bMKR_D10;
  assign bNINA_PIO27 = bMKR_D11;
  assign bNINA_RESETN = bMKR_D31;
  assign bNINA_RxD = bMKR_D0;

  // Other names for the same wires on the sheet: clk_12_288MHz = bMKR_D18; clk_48MHz = iCLK

  // Notes on the sheet:
  //   Direct Digital Frequency Synthesis (DDFS)
  //   Change amplitude to match 24bit audio
  //   Creates sine-wave as 8-bit signed data
  //   Input: I2S Receiver from external ADC in Slave-Mode
  //   This block takes a selection of bits of the audiosignal and put them in a 8-bit vector. These vectors will be sent to
  //   the ESP32 (NINA W102) to relay them to the Webinterface to the VU-meter. Nice, simple and very fast solution :)
  //   VU-Meter
  //   This block uses 1x fsclk and is set to 48kHz x 2 x 32bit = 3.072MHz
  //   44.1kHz = 2.8224MHz
  //   48kHz = 3.072MHz
  //   96kHz = 6.144MHz
  //   Clock-Generations derived from 48MHz main-clock
  //   Frequency Crossover Section with 24dB/oct Linkwitz-Riley
  //   Input: I2S Receiver from external ADC in Master-Mode
  //   Noisegate for Analog Input
  //   PEQ-Section
  //   Create Mono-Sum for Subwoofer
  //   Compressor Section
  //   Mainfader-section
  //   Conversion to 24bit / Clipping Section
  //   Audio Oversampling to get a Samplerate of 5MHz for better sound-quality above ~5kHz
  //   Analog audio-output (PDM-Signal with 5MHz)
  //   Audio Mixing-Bus
  //   Linkwitz-Riley-Filter Left + Right + Subwoofer
  //   There is also a I2S-Master-Block in this project that could be used to create
  //   This filter will cut all frequencies above 20kHz with 24dB/oct. This is useful as we sample with 48kHz and have
  //   Two-Stage Sigma-Delta-Converter with Noise-Shaping
  //   timing-signals for an ADC running in Slave-Mode
  //   only 4.8 Samples for e.g. 10kHz frequency. This filter will shape a perfect sinewave up to 20kHz so that the PDM
  //   with 5MHz can output a clean sinewave instead of a signal with stairsteps so that the hardware LowPass
  //   Creates a mono-signal out of a stereo-signal
  //   has way less to do :)
  //   IIR-Filter 5 (PEQ5)
  //   IIR-Filter 4 (PEQ4)
  //   IIR-Filter 3 (PEQ3)
  //   IIR-Filter 2 (PEQ2)
  //   IIR-Filter 1 (PEQ1)
  //   Using 10MHz to achieve 105x decimation-ratio to get clean 48kHz Audio (results in 5MHz switching)
  //   Mainclock for ADC (256 x 48kHz = 12.288MHz)
  //   Analog audio-output (PDM-Signal with 5MHz)
  //   Two-Stage Sigma-Delta-Converter with Noise-Shaping
  //   No clipping can happen here, so we will stay at 36-bit
  //   Clips audio with saturation to 24-bit
  //   Input: I2S Receiver from NINA-W102 (SD-Card)
  //   Audio-Sync-Selector
  //   Read I2S-Data into std_logic_vectors
  //   Signal-Passthrough to NINA-W102 Module (Communication, RESET and Bootselect)
  //   The Cyclone 10LP FPGA of the Vidor 4000 has only 15,408 Logic Elements. Two LR24 Filters are not fitting.
  //   Using 10MHz to achieve 105x decimation-ratio to get clean 48kHz Audio (results in 5MHz switching)
  //   You can choose if you like a crossover for Stereo+Sub, of the Output-Filter for slightly better Audio-Quality at the Output
  //   Even if you choose this Output-Filter, you have to apply a Low-Pass-Filter in Hardware!
  //   Analog audio-output (PDM-Signal with 5MHz)
  //   No clipping can happen here, so we will stay at 24-bit
  //   Two-Stage Sigma-Delta-Converter with Noise-Shaping
  //   RESET-signal
  //   A wrong sync-source results in slight sampling errors that may (will) cause
  //   disturbances in higher audio-frequencies from 5kHz upwards...
  //   boot-mode
  //   Input: I2S Receiver from NINA-W102 (Bluetooth A2DP)
  //   Audio-Clock-Selector
  //   44.1kHz = 5.6448MHz
  //   48kHz = 6.144MHz
  //   96kHz = 12.288MHz
  //   Signal-Passthrough to NINA-W102 Module (SPI-Communication)
  //   SPI-MISO
  //   Using 10MHz to achieve 105x decimation-ratio to get clean 48kHz Audio (results in 5MHz switching)
  //   SPI-MOSI
  //   Digital audio-output (SPDIF-Signal)
  //   SPI-SCK
  //   Thie audio-clock (fsclk_audio) is used for SPDIF digital output timing.
  //   SPI-CS
  //   The three PDM-channels uses their own 5MHz clock and are independant of this clock.
  //   !IMPORTANT! PIO32 selects UART0 Debug-Output during Boot. We are using it as input, so everything is fine.
  //   unused input/output from/to NINA-W102
  //   !IMPORTANT! PIO36 controls flash-voltage during boot. We are using it as input, so everything is fine.
  //   Output sample-data to SP/DIF-connector
  //   SPDIF-Bit-Clock (48kHz x (4bit + 24bit + 4bit) x 2 channels x 2) = 6.144MHz
  //   RS232/UART-Receiver for communication with NINA-W102 (ESP32) Microcontroller
  //   Input: AES/EBU Receiver for digital SPDIF-Audio (2 Channels)
  //   Convert AES-Data into std_logic_vectors
  //   We expect Stereo here
  //   so Ch3..Ch8 are not used
  //   For receiving Behringer UltraNet we
  //   need a higher samplerate of 200MHz
  //   for SPDIF, 100MHz are sufficient
  //   For receiving Behringer UltraNet
  //   change to 8 audio-channels
  //   For receiving standard SPDIF
  //   change to 2 audio-channels
  //   Input: AES/EBU Receiver A for Behringer UltraNet (8 Channels)
  //   Convert AES-Data into std_logic_vectors
  //   For receiving Behringer UltraNet we
  //   need a higher samplerate of 200MHz
  //   for SPDIF, 100MHz are sufficient
  //   For receiving Behringer UltraNet
  //   change to 8 audio-channels
  //   For receiving standard SPDIF
  //   change to 2 audio-channels
  //   Input: AES/EBU Receiver B for Behringer UltraNet (8 Channels)
  //   Convert AES-Data into std_logic_vectors
  //   For receiving Behringer UltraNet we
  //   need a higher samplerate of 200MHz
  //   for SPDIF, 100MHz are sufficient
  //   For receiving Behringer UltraNet
  //   change to 8 audio-channels
  //   For receiving standard SPDIF
  //   change to 2 audio-channels
endmodule
